# EasyEDA schematic Schematic_Wankler.json
TITLE: Wankler Interface Board; REV: 1.0; Date: 2020-06-14; Sheet: 1/1; Drawn By: senfkorn; Company: Wolf Design
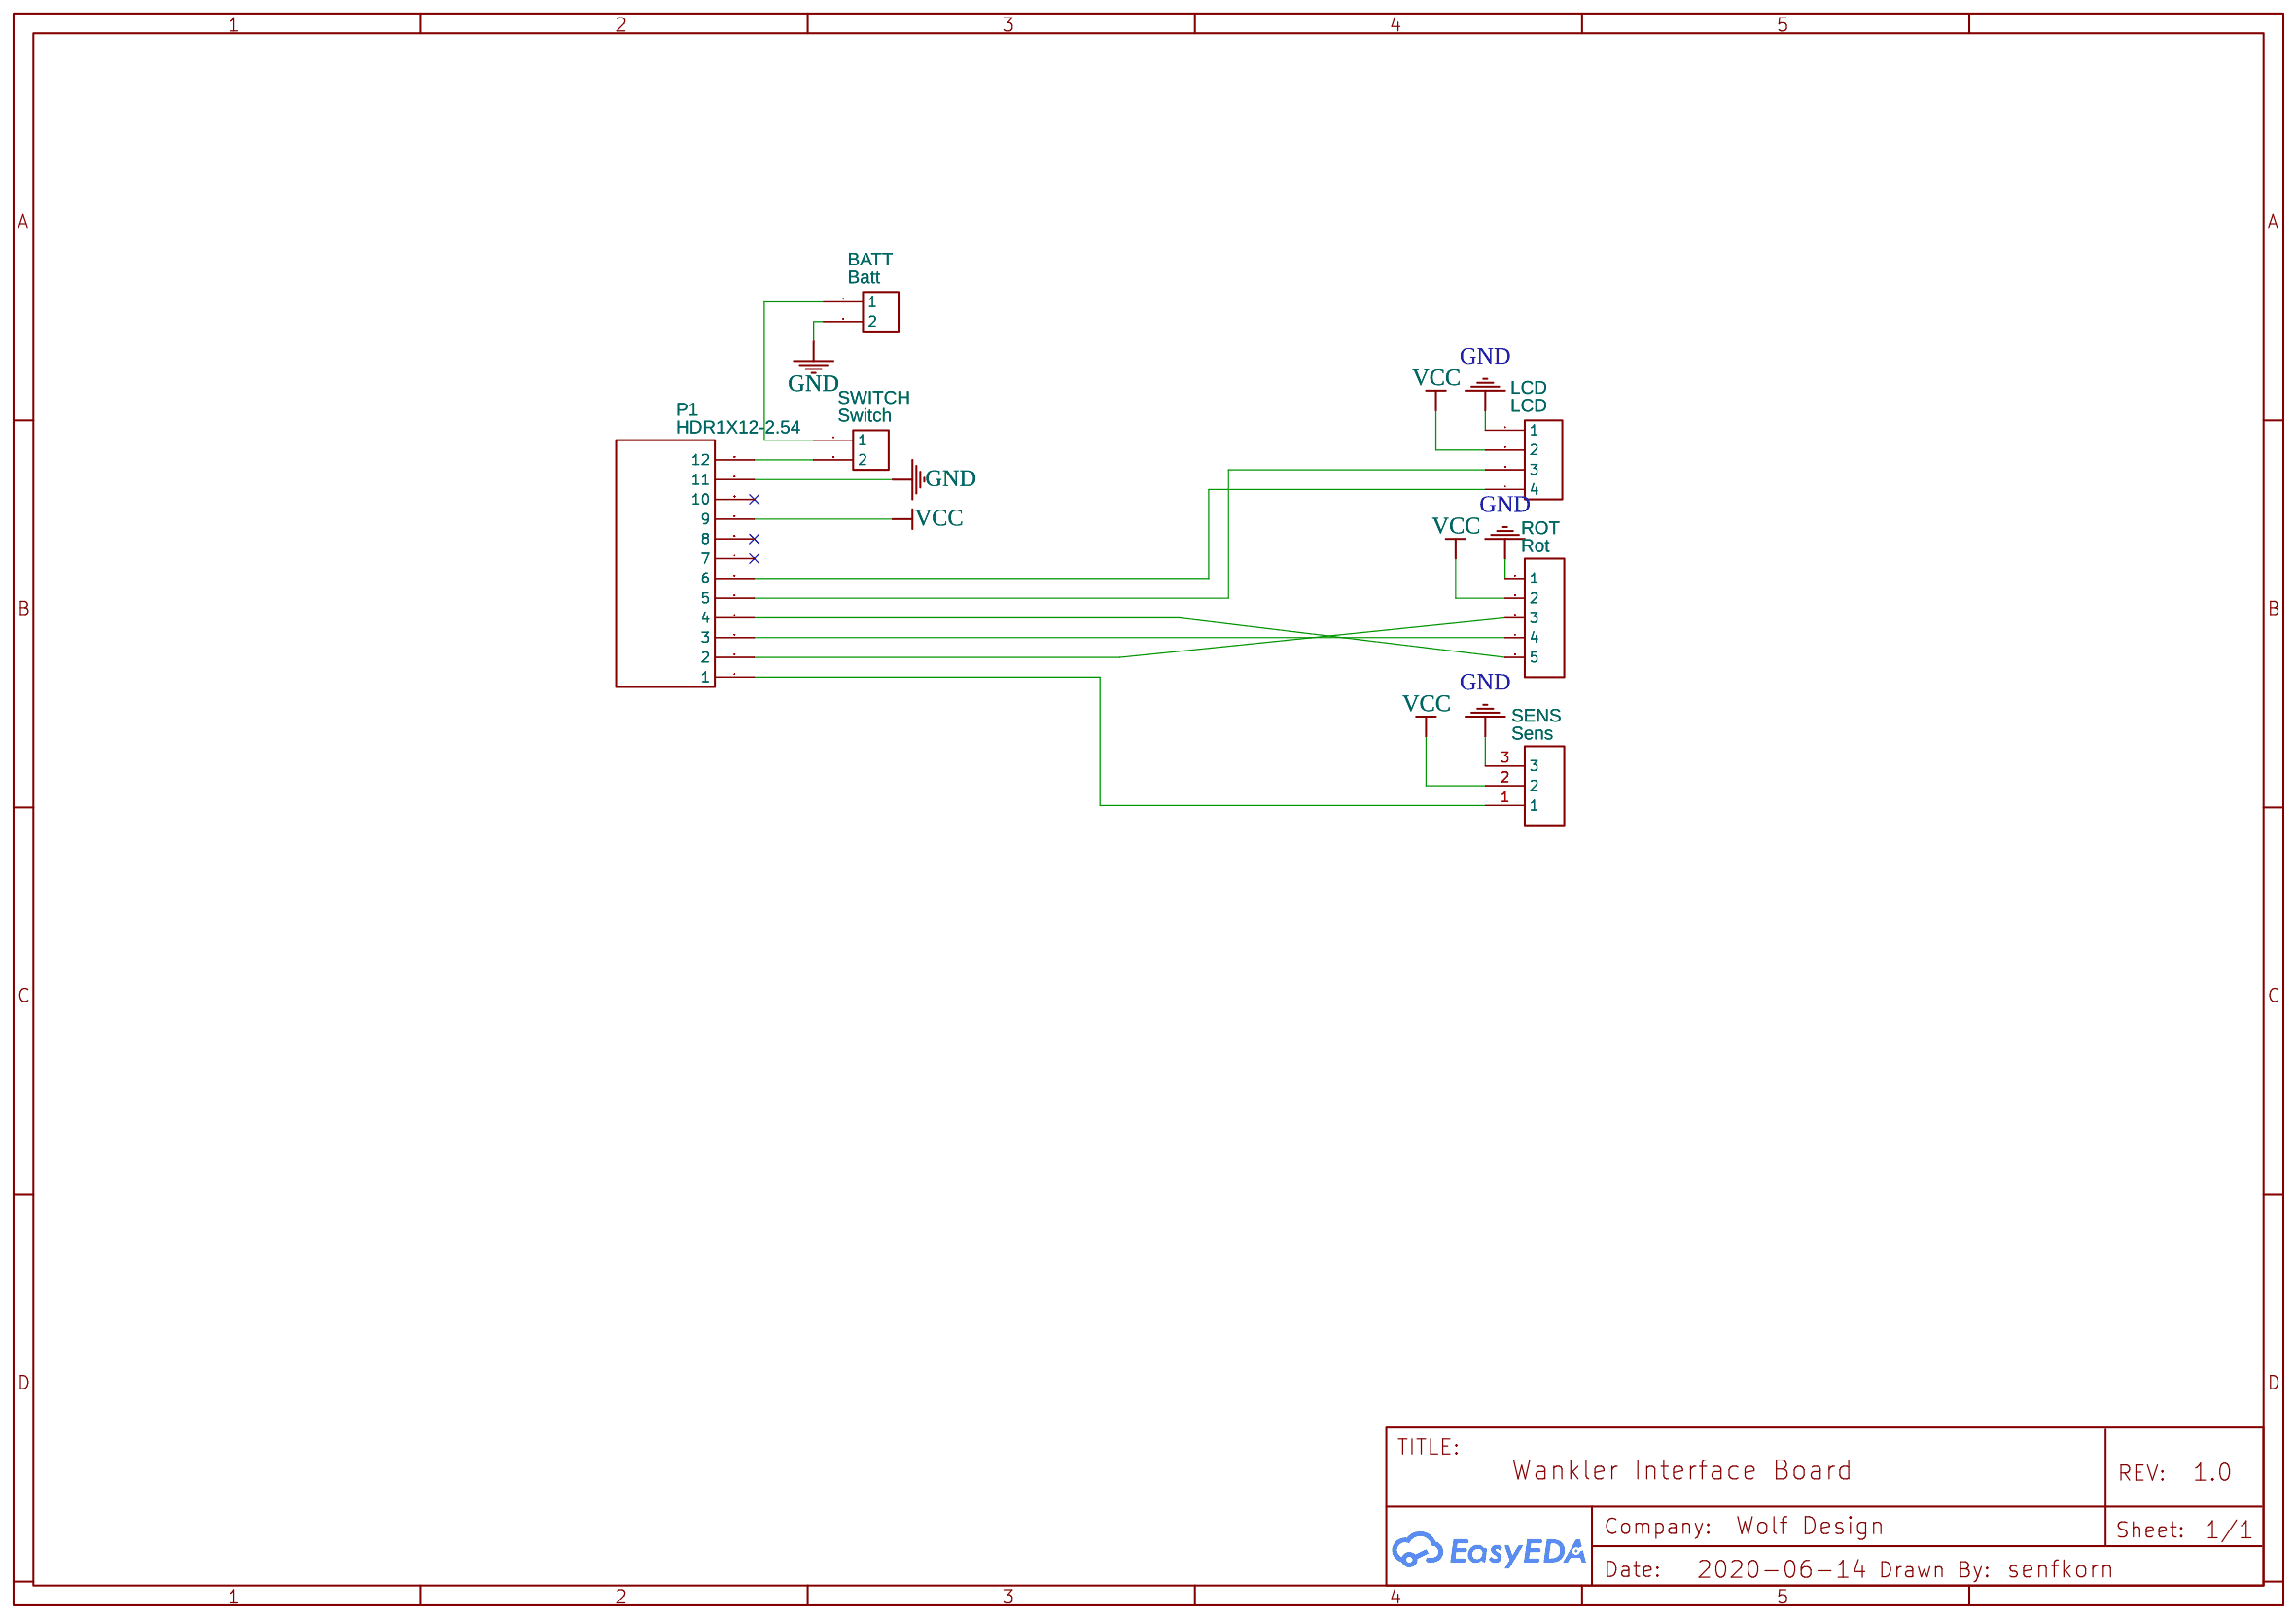
[diagram p0: schematic sheet]

## Parts
BATT  Batt  [HDR-2X1/2.54]
LCD  LCD  [HDR-4X1/2.54]
P1  HDR1X12-2.54  [HDR1X12]
ROT  Rot  [HDR-5X1/2.54]
SENS  Sens  [HDR1X3]
SWITCH  Switch  [HDR-2X1/2.54]

## Library data of the parts
BATT SWITCH = HDR-2x1/2.54: Contributor: dfemery
LCD = HDR-4x1/2.54: Contributor: dfemery
P1 = HDR1X12-2.54: Supplier Part: C27438; Supplier: LCSC; Manufacturer: BOOMELE; Manufacturer Part: Female headerHDR1X8-2.54; Contributor: chifai
ROT = HDR-2.54_1x5: Supplier: LCSC; Manufacturer: BOOMELE; Manufacturer Part: 2.54mm 1*5p Female header; image: //image.lceda.cn/szlcsc/C50950.jpg; Supplier Part: C50950; Contributor: mslr
SENS = HDR-3x1/2.54: sourceId: oeca7tPNL

## Nets
GND: BATT.2 LCD.1 P1.11 ROT.1 SENS.3
VCC: LCD.2 P1.9 ROT.2 SENS.2
Net-(BATT-1): BATT.1 SWITCH.1
Net-(LCD-3): LCD.3 P1.5
Net-(LCD-4): LCD.4 P1.6
Net-(P1-1): P1.1 SENS.1
Net-(P1-2): P1.2 ROT.3
Net-(P1-3): P1.3 ROT.4
Net-(P1-4): P1.4 ROT.5
Net-(P1-12): P1.12 SWITCH.2

Not connected (* = marked no-connect by the designer): P1 7* 8* 10*
